# Altium schematic sheet Remote.SchDoc: Remote
size A4; SheetNumber: 8; SheetTotal: 8
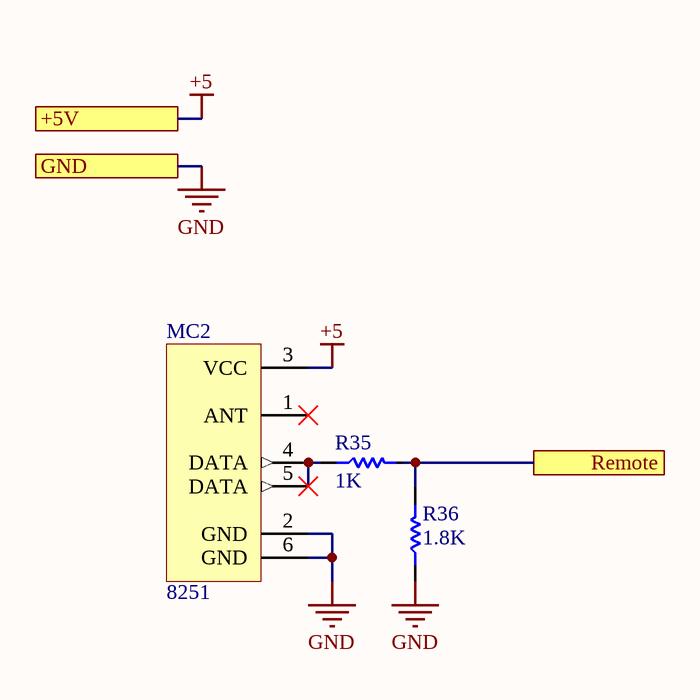
[diagram p0: Remote.SchDoc]

## Parts
MC2  Inflow: 8251  [RF_ETRXB]  (hidden comment: RXB22)
R35  1K  [RES 0805 (2012X06L)]
R36  1.8K  [RES 0805 (2012X06L)]

## Ports
+5V, GND, Remote

## Nets
+5: MC2.3(VCC) ; port +5V
GND: MC2.2(GND) MC2.6(GND) R36.1 ; port GND
Remote: R35.2 R36.2 ; port Remote
NetMC2_4: MC2.4(DATA) MC2.5(DATA) R35.1

Not connected (* = marked no-connect by the designer): MC2 1(ANT)*

## Notes on the sheet
- Title:
- Project:
- Drawn by:
- Revision:
- Hossein Bagheri
- Company:
- Sheet
- of

## Library data of the parts
MC2 = ModSen_Com_RXB22_433: JMR RXB22 433MHz ASK superheterodyne wireless receiving module; Rating: 433M; Validation: NT; Value: RXB22; Package: Dip; Type: Learning
R35 R36 = Res_SMD_0805: Resistor; Inflow: inflow?; Rating: 0.125W; Validation: Valid; Package: 0805; Type: 10%
  R35: Value: 1K
  R36: Value: 1.8K